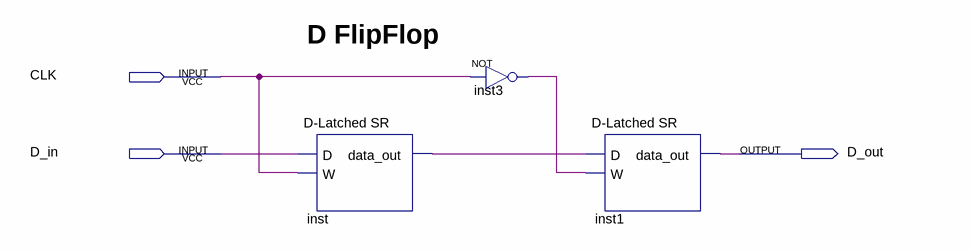
[diagram p0: schematic sheet]
// Quartus schematic D FlipFlop.bdf as structural Verilog: 3 symbols, 3 pins
module \D_FlipFlop  (
  input  CLK,
  input  D_in,
  output D_out
);

  wire inst3_out, inst_data_out;

  \D-Latched_SR  inst (.D(D_in), .W(CLK), .data_out(inst_data_out));
  not inst3 (inst3_out, CLK);
  \D-Latched_SR  inst1 (.D(inst_data_out), .W(inst3_out), .data_out(D_out));

  // Notes on the sheet:
  //   D FlipFlop
endmodule
